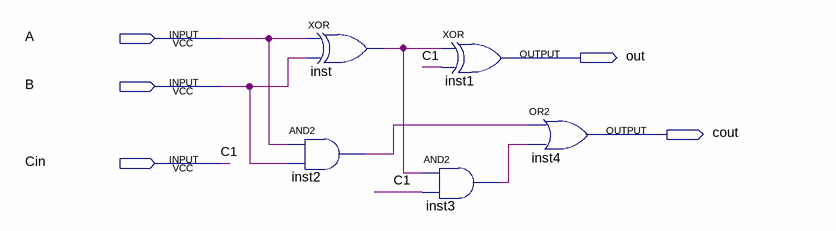
[diagram p0: schematic sheet]
// Quartus schematic full_adder.bdf as structural Verilog: 5 symbols, 5 pins
module full_adder (
  input  A,
  input  B,
  input  Cin,
  output out,
  output cout
);

  wire inst2_out, inst3_out, inst_out;

  xor inst (inst_out, A, B);
  and inst2 (inst2_out, A, B);
  xor inst1 (out, inst_out, Cin);
  and inst3 (inst3_out, inst_out, Cin);
  or inst4 (cout, inst2_out, inst3_out);

  // Other names for the same wires on the sheet: C1 = Cin
endmodule
